# EAGLE design Clamp Circuit (EAGLE 5.12)
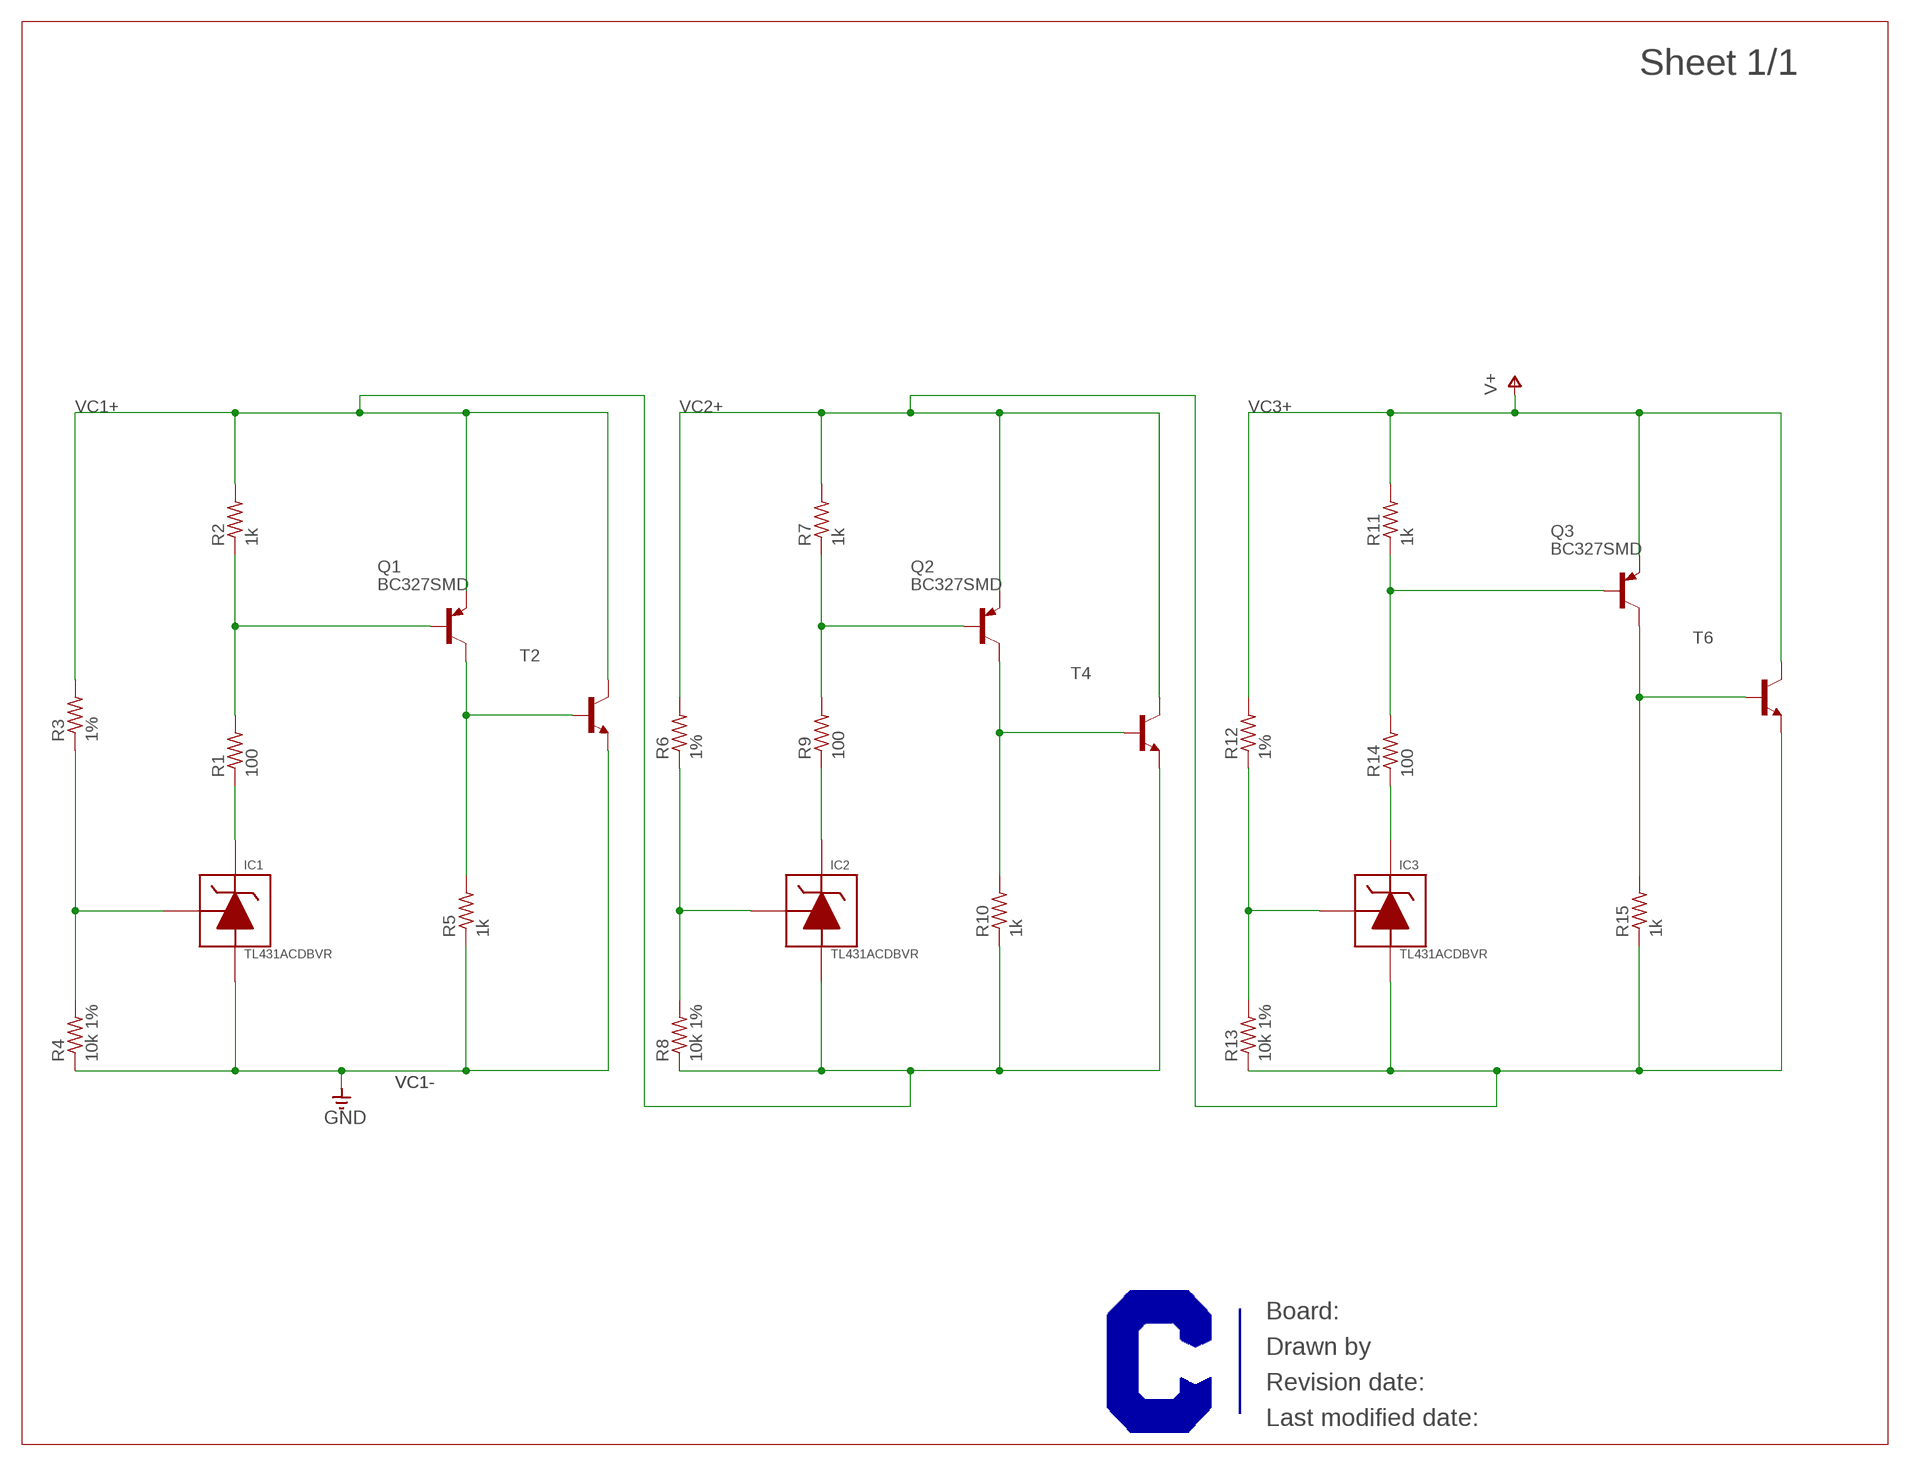
[diagram p0: schematic, sheet 1, part 1 of 2]
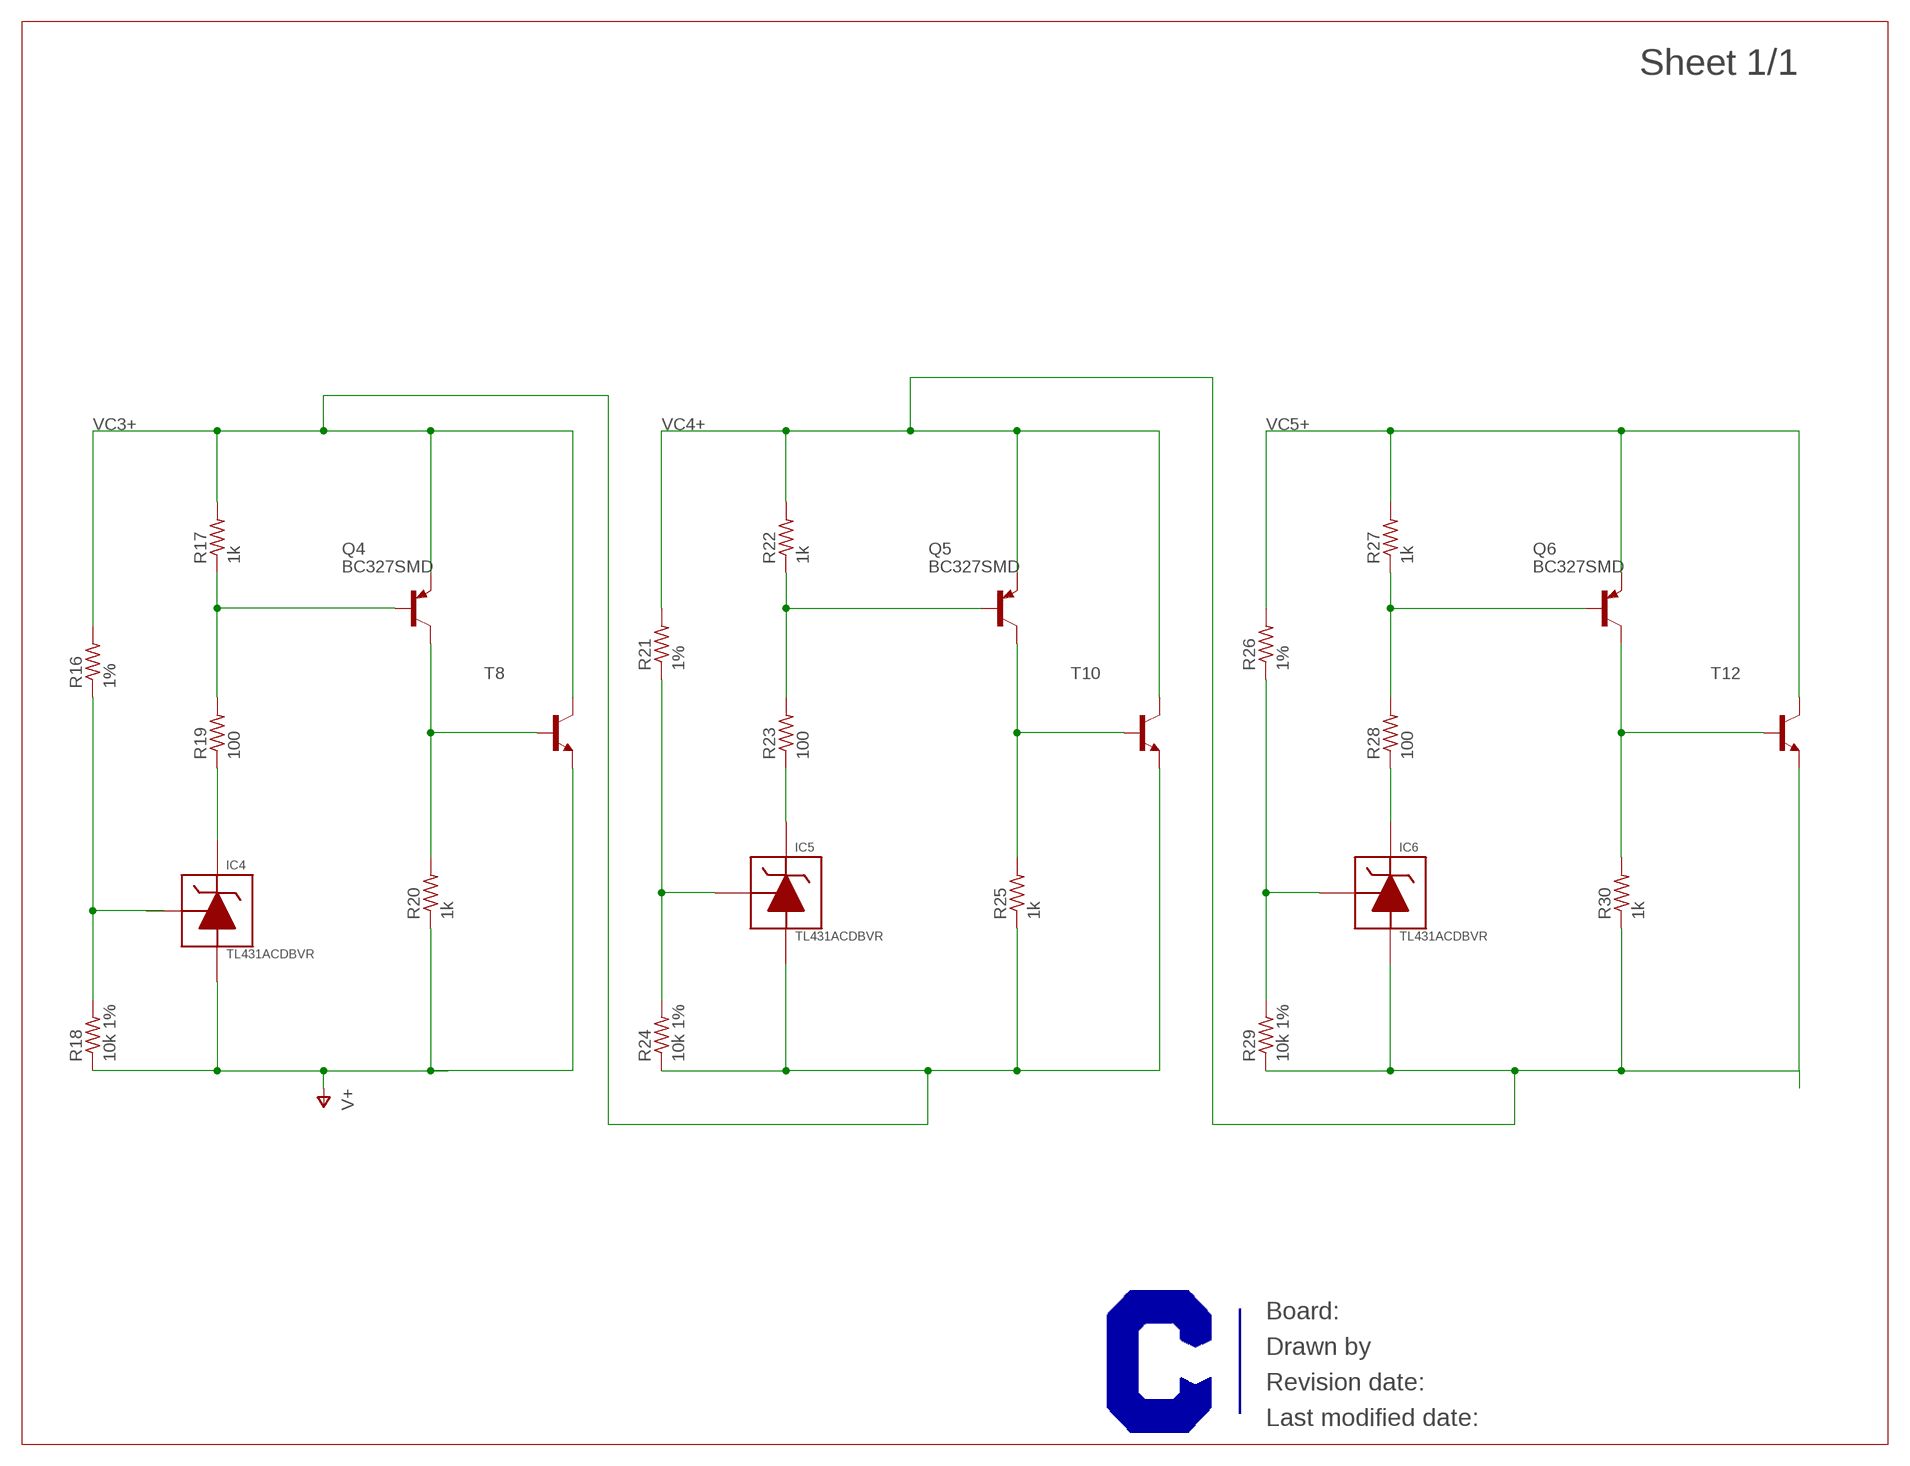
[diagram p1: schematic, sheet 1, part 2 of 2]

## Parts
IC1  TL431ACDBVR  [SOT-23-5_(DBV-R-PDSO-G5)]
IC2  TL431ACDBVR  [SOT-23-5_(DBV-R-PDSO-G5)]
IC3  TL431ACDBVR  [SOT-23-5_(DBV-R-PDSO-G5)]
IC4  TL431ACDBVR  [SOT-23-5_(DBV-R-PDSO-G5)]
IC5  TL431ACDBVR  [SOT-23-5_(DBV-R-PDSO-G5)]
IC6  TL431ACDBVR  [SOT-23-5_(DBV-R-PDSO-G5)]
Q1  BC327SMD  [SOT23-BEC]
Q2  BC327SMD  [SOT23-BEC]
Q3  BC327SMD  [SOT23-BEC]
Q4  BC327SMD  [SOT23-BEC]
Q5  BC327SMD  [SOT23-BEC]
Q6  BC327SMD  [SOT23-BEC]
R1  100  R-US_R0603  [R0603]
R2  1k  R-US_R0603  [R0603]
R3  1%  R-US_R0603  [R0603]
R4  10k 1%  R-US_R0603  [R0603]
R5  1k  R-US_R0603  [R0603]
R6  1%  R-US_R0603  [R0603]
R7  1k  R-US_R0603  [R0603]
R8  10k 1%  R-US_R0603  [R0603]
R9  100  R-US_R0603  [R0603]
R10  1k  R-US_R0603  [R0603]
R11  1k  R-US_R0603  [R0603]
R12  1%  R-US_R0603  [R0603]
R13  10k 1%  R-US_R0603  [R0603]
R14  100  R-US_R0603  [R0603]
R15  1k  R-US_R0603  [R0603]
R16  1%  R-US_R0603  [R0603]
R17  1k  R-US_R0603  [R0603]
R18  10k 1%  R-US_R0603  [R0603]
R19  100  R-US_R0603  [R0603]
R20  1k  R-US_R0603  [R0603]
R21  1%  R-US_R0603  [R0603]
R22  1k  R-US_R0603  [R0603]
R23  100  R-US_R0603  [R0603]
R24  10k 1%  R-US_R0603  [R0603]
R25  1k  R-US_R0603  [R0603]
R26  1%  R-US_R0603  [R0603]
R27  1k  R-US_R0603  [R0603]
R28  100  R-US_R0603  [R0603]
R29  10k 1%  R-US_R0603  [R0603]
R30  1k  R-US_R0603  [R0603]
T2  -NPN-TO220V  [TO220V]
T4  -NPN-TO220V  [TO220V]
T6  -NPN-TO220V  [TO220V]
T8  -NPN-TO220V  [TO220V]
T10  -NPN-TO220V  [TO220V]
T12  -NPN-TO220V  [TO220V]
U$1  CURRENT-C-LETTER-LANDSCAPE  [BLANK]
U$2  CURRENT-C-LETTER-LANDSCAPE  [BLANK]

## Nets
N$1: IC1.3(CATHODE) R1.1
N$2: Q1.B R1.2 R2.1
N$3: IC1.4(REF) R3.1 R4.2
N$4: IC2.4(REF) R6.1 R8.2
N$6: Q1.C R5.2 T2.1(B)
N$7: IC2.3(CATHODE) R9.1
N$8: Q2.B R7.1 R9.2
N$9: Q2.C R10.2 T4.1(B)
N$12: IC3.4(REF) R12.1 R13.2
N$14: Q3.B R11.1 R14.2
N$15: IC3.3(CATHODE) R14.1
N$16: Q3.C R15.2 T6.1(B)
N$19: R16.1 R18.2
N$20: Q4.B R17.1 R19.2
N$21: IC4.3(CATHODE) R19.1
N$23: Q4.C R20.2 T8.1(B)
N$24: Q5.B R22.1 R23.2
N$25: IC5.4(REF) R21.1 R24.2
N$26: Q6.B R27.1 R28.2
N$27: IC5.3(CATHODE) R23.1
N$28: Q5.C R25.2 T10.1(B)
N$29: IC6.3(CATHODE) R28.1
N$31: IC6.4(REF) R26.1 R29.2
N$33: Q6.C R30.2 T12.1(B)
V+: IC4.5(ANODE) R18.1 R20.1 T8.3(E)
VC1+: IC2.5(ANODE) Q1.E R2.2 R3.2 R8.1 R10.1 T2.2(C) T4.3(E)
VC1-: IC1.5(ANODE) R4.1 R5.1 T2.3(E) ; supply symbol labelled GND
VC2+: IC3.5(ANODE) Q2.E R6.2 R7.2 R13.1 R15.1 T4.2(C) T6.3(E)
VC3+: IC5.5(ANODE) Q3.E Q4.E R11.2 R12.2 R16.2 R17.2 R24.1 R25.1 T6.2(C) T8.2(C) T10.3(E) ; supply symbol labelled V+
VC4+: IC6.5(ANODE) Q5.E R21.2 R22.2 R29.1 R30.1 T10.2(C) T12.3(E)
VC5+: Q6.E R26.2 R27.2 T12.2(C)
Unconnected: IC4.4(REF)

## Library data of the parts
IC1-IC6 = TI:TL431: http://www.ti.com/lit/ds/symlink/tl431a.pdf MR-2-22-15; PARTNO: TL431ACDBVR
Q1-Q6 = transistor-pnp:BC327*: PNP Transistror
R1-R30 = rcl:R-US_: RESISTOR, American symbol
T2 T4 T6 T8 T10 T12 = transistor:*-NPN-: NPN Transistror BF959 corrected 2008.03.06
U$1 U$2 = Frames:CURRENT-C-LETTER-LANDSCAPE; BOM: EXCLUDE

## Board
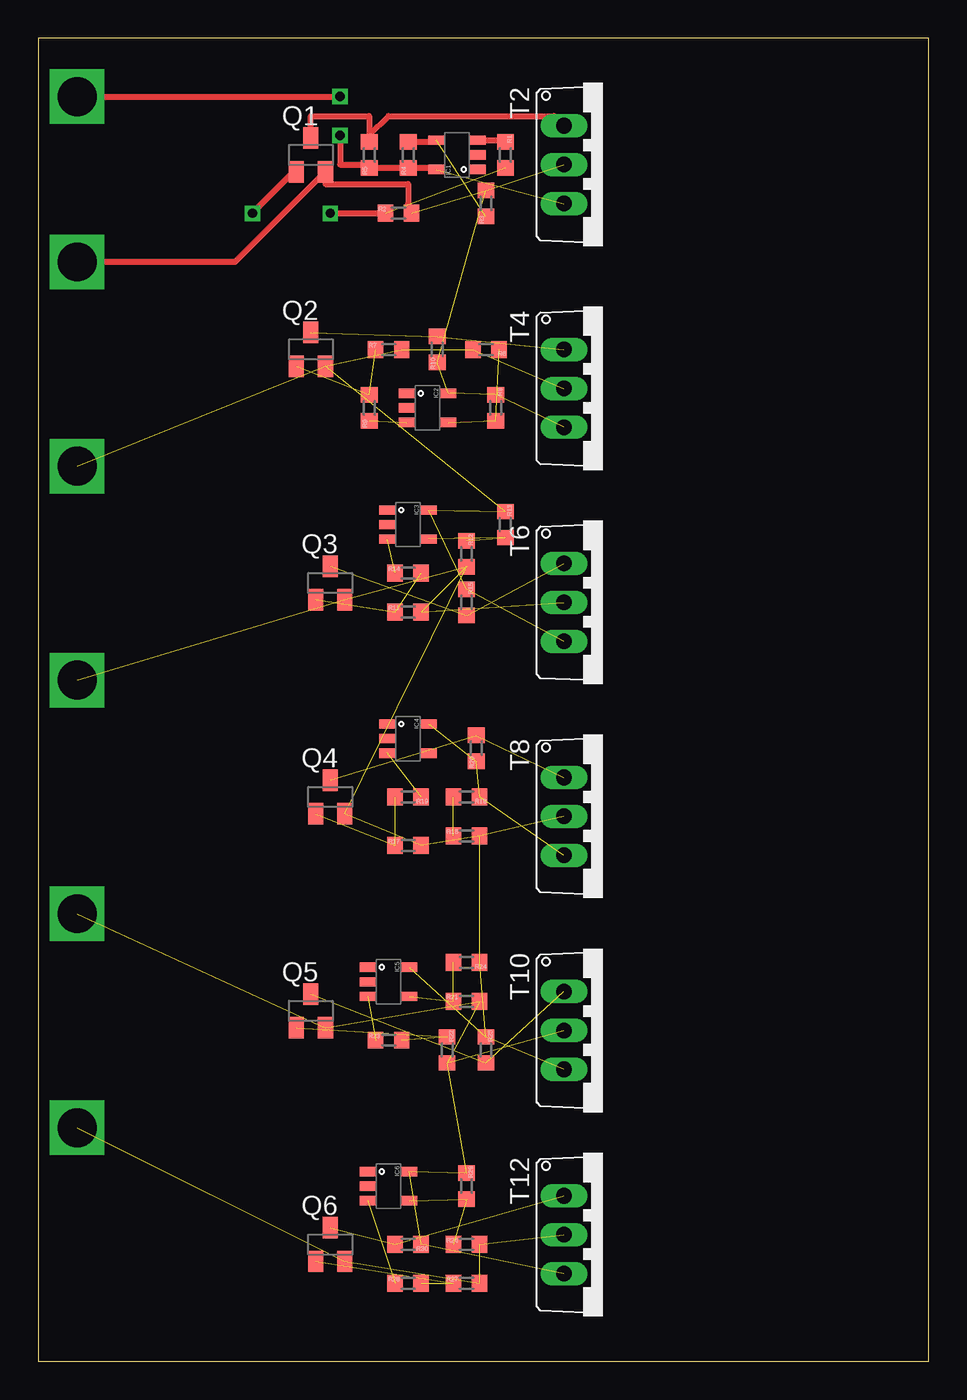
[diagram p2: board, top side]
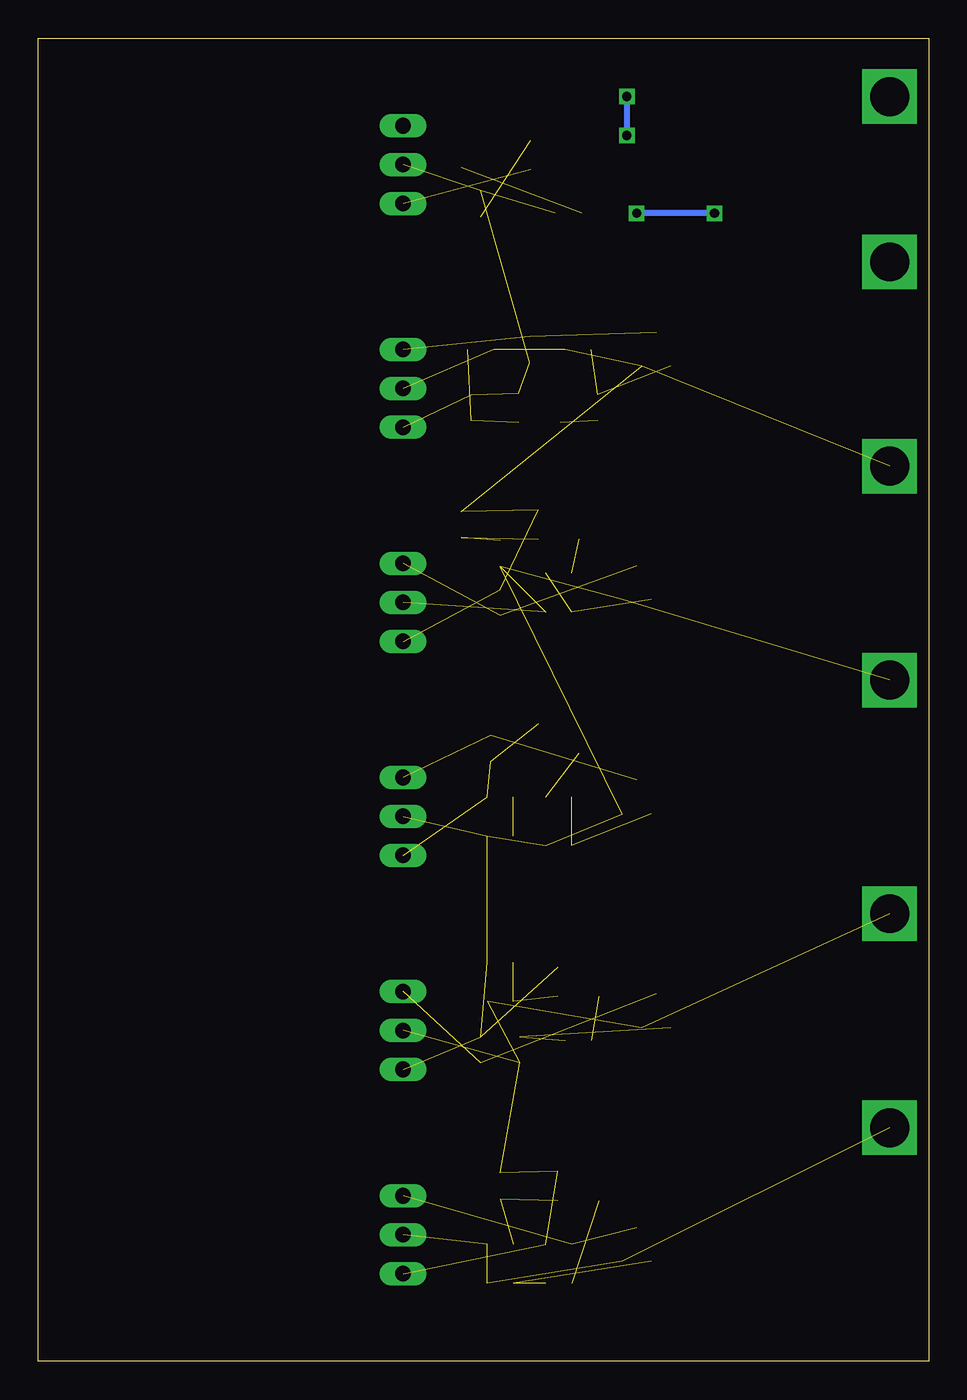
[diagram p3: board, bottom side, seen from below]

Size 58.09 x 86.35 mm. Coordinates in mm from the lower left corner, seen from the top.
Outline: 0,0 58.09,0 58.09,86.35 0,86.35 0,0
Copper layers (1*16): Top 0.035mm / dielectric 1.5mm / Bottom 0.035mm
Design rules "default": minimum track width 10mil, minimum drill 24mil, track to track 8mil, track to pad 8mil, pad to pad 8mil, via to via 8mil, smd to smd 8mil, copper to edge 40mil, drill to drill 8mil, minimum pad ring 10mil, minimum via ring 8mil, stop-mask expansion 4mil, vias tented up to drill 0mil, thermal gap 10mil

### Footprints (pad centres in the part's own frame; a part is rotated, then mirrored left to right if it is on the bottom)
SOT-23-5_(DBV-R-PDSO-G5) = smd 0.6 x 1.05: 1 -0.95,-1.35; 2 0,-1.35; 3 0.95,-1.35; 4 0.95,1.35; 5 -0.95,1.35
SOT23-BEC = smd 1 x 1.4: B -0.95,-1.1; C 0,1.1; E 0.95,-1.1
R0603 = smd 1 x 1.1: 1 -0.85,0; 2 0.85,0
TO220V = drill 1.016 long: 1 -2.54,-2.54; 2 0,-2.54; 3 2.54,-2.54

### Placement (x,y rotation side)
IC1  27.3,78.74 90 top
IC2  25.4,62.23 270 top
IC3  24.13,54.61 270 top
IC4  24.13,40.64 270 top
IC5  22.86,24.77 270 top
IC6  22.86,11.43 270 top
Q1  17.78,78.74 0 top
Q2  17.78,66.04 0 top
Q3  19.05,50.8 0 top
Q4  19.05,36.83 0 top
Q5  17.78,22.86 0 top
Q6  19.05,7.62 0 top
R1  30.48,78.74 270 top
R2  23.5,74.93 0 top
R3  29.21,75.56 90 top
R4  24.13,78.74 90 top
R5  21.59,78.74 90 top
R6  29.21,66.04 180 top
R7  22.86,66.04 0 top
R8  29.84,62.23 270 top
R9  21.59,62.23 90 top
R10  26.04,66.04 90 top
R11  24.13,48.9 0 top
R12  27.94,52.7 270 top
R13  30.48,54.61 270 top
R14  24.13,51.44 0 top
R15  27.94,49.53 270 top
R16  27.94,34.29 0 top
R17  24.13,33.66 0 top
R18  27.94,36.83 180 top
R19  24.13,36.83 180 top
R20  28.57,40.01 90 top
R21  27.94,23.5 0 top
R22  26.67,20.32 270 top
R23  22.86,20.95 0 top
R24  27.94,26.04 180 top
R25  29.21,20.32 270 top
R26  27.94,7.62 0 top
R27  27.94,5.08 0 top
R28  24.13,5.08 0 top
R29  27.94,11.43 270 top
R30  24.13,7.62 180 top
T2  36.83,78.11 270 top
T4  36.83,63.5 270 top
T6  36.83,49.53 270 top
T8  36.83,35.56 270 top
T10  36.83,21.59 270 top
T12  36.83,8.26 270 top
U$1  -19.05,20.32 0 top  (outside the outline)
U$2  -24.13,-34.29 0 top  (outside the outline)

### Tracks (layer width: path | path; a pad name or v marks a point on that pad's centre or on a via)
N$1
  Top 0.406: IC1.3 30.48,79.69 R1.1
N$2  (via drill 0.6)  (1 unrouted)
  Top 0.406: Q1.B 16.68,77.64 v13.97,74.93 | v19.05,74.93 R2.1
  Bottom 0.406: v13.97,74.93 v19.05,74.93
N$3  (1 unrouted)
  Top 0.406: R4.2 25.95,79.59 IC1.4
N$4  (2 unrouted)
N$6
  Top 0.406: Q1.C 17.78,81.28 21.59,81.28 R5.2 21.59,80.01 22.86,81.28 33.66,81.28 T2.1
N$7  (1 unrouted)
N$8  (2 unrouted)
N$9  (2 unrouted)
N$12  (2 unrouted)
N$14  (2 unrouted)
N$15  (1 unrouted)
N$16  (2 unrouted)
N$19  (1 unrouted)
N$20  (2 unrouted)
N$21  (1 unrouted)
N$23  (2 unrouted)
N$24  (2 unrouted)
N$25  (2 unrouted)
N$26  (2 unrouted)
N$27  (1 unrouted)
N$28  (2 unrouted)
N$29  (1 unrouted)
N$31  (2 unrouted)
N$33  (2 unrouted)
V+  (3 unrouted)
VC1+  (via drill 2.54)  (6 unrouted)
  Top 0.406: v2.54,71.75 12.85,71.75 Q1.E 18.73,76.83 24.13,76.83 24.13,75.56 R2.2
VC1-  (via drill 0.6, 2.54)  (1 unrouted)
  Top 0.406: IC1.5 25.95,77.89 R4.1 R5.1 21.59,78.11 19.68,78.11 v19.68,80.01 | v2.54,82.55 v19.68,82.55
  Bottom 0.406: v19.68,82.55 v19.68,80.01
VC2+  (via drill 2.54)  (8 unrouted)
  other vias: 2.54,58.42
VC3+  (via drill 2.54)  (12 unrouted)
  other vias: 2.54,44.45
VC4+  (via drill 2.54)  (8 unrouted)
  other vias: 2.54,29.21
VC5+  (via drill 2.54)  (4 unrouted)
  other vias: 2.54,15.24